# Altium schematic sheet dmpro16-pcb-v1-FPGA-Bank14.SchDoc
size A4; DocumentNumber: 5; SheetNumber: 5; SheetTotal: 17; SheetName: FPGA-Bank14
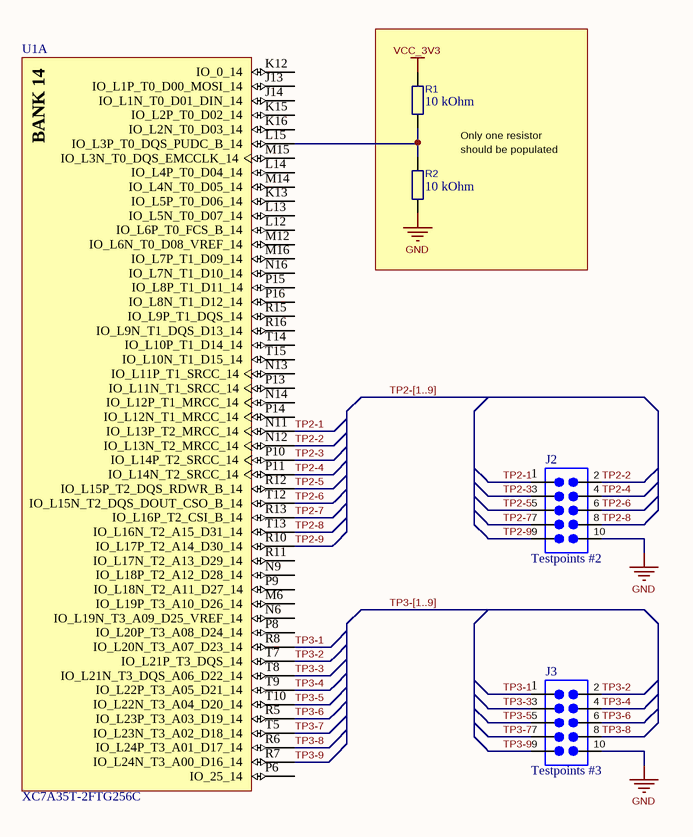
[diagram p0: dmpro16-pcb-v1-FPGA-Bank14.SchDoc]

## Parts
J2  Testpoints #2  [HEADER_2X5]
J3  Testpoints #3  [HEADER_2X5]
R1  10 kOhm  [Resistor 2012]
R2  10 kOhm  [Resistor 2012]
U1  XC7A35T-2FTG256C  [FTG256]  (part A of 8)

## Nets
GND: J2.10 J3.10 R2.2
VCC_3V3: R1.1
TP2-1: J2.1 U1.N11(IO_L13P_T2_MRCC_14)
TP2-2: J2.2 U1.N12(IO_L13N_T2_MRCC_14)
TP2-3: J2.3 U1.P10(IO_L14P_T2_SRCC_14)
TP2-4: J2.4 U1.P11(IO_L14N_T2_SRCC_14)
TP2-5: J2.5 U1.R12(IO_L15P_T2_DQS_RDWR_B_14)
TP2-6: J2.6 U1.T12(IO_L15N_T2_DQS_DOUT_CSO_B_14)
TP2-7: J2.7 U1.R13(IO_L16P_T2_CSI_B_14)
TP2-8: J2.8 U1.T13(IO_L16N_T2_A15_D31_14)
TP2-9: J2.9 U1.R10(IO_L17P_T2_A14_D30_14)
TP3-1: J3.1 U1.R8(IO_L20N_T3_A07_D23_14)
TP3-2: J3.2 U1.T7(IO_L21P_T3_DQS_14)
TP3-3: J3.3 U1.T8(IO_L21N_T3_DQS_A06_D22_14)
TP3-4: J3.4 U1.T9(IO_L22P_T3_A05_D21_14)
TP3-5: J3.5 U1.T10(IO_L22N_T3_A04_D20_14)
TP3-6: J3.6 U1.R5(IO_L23P_T3_A03_D19_14)
TP3-7: J3.7 U1.T5(IO_L23N_T3_A02_D18_14)
TP3-8: J3.8 U1.R6(IO_L24P_T3_A01_D17_14)
TP3-9: J3.9 U1.R7(IO_L24N_T3_A00_D16_14)
NetR1_2: R1.2 R2.1 U1.L15(IO_L3P_T0_DQS_PUDC_B_14)

Not connected (* = marked no-connect by the designer): U1 J13(IO_L1P_T0_D00_MOSI_14) J14(IO_L1N_T0_D01_DIN_14) K12(IO_0_14) K13(IO_L5P_T0_D06_14) K15(IO_L2P_T0_D02_14) K16(IO_L2N_T0_D03_14) L12(IO_L6P_T0_FCS_B_14) L13(IO_L5N_T0_D07_14) L14(IO_L4P_T0_D04_14) M6(IO_L19P_T3_A10_D26_14) M12(IO_L6N_T0_D08_VREF_14) M14(IO_L4N_T0_D05_14) M15(IO_L3N_T0_DQS_EMCCLK_14) M16(IO_L7P_T1_D09_14) N6(IO_L19N_T3_A09_D25_VREF_14) N9(IO_L18P_T2_A12_D28_14) N13(IO_L11P_T1_SRCC_14) N14(IO_L12P_T1_MRCC_14) N16(IO_L7N_T1_D10_14) P6(IO_25_14) P8(IO_L20P_T3_A08_D24_14) P9(IO_L18N_T2_A11_D27_14) P13(IO_L11N_T1_SRCC_14) P14(IO_L12N_T1_MRCC_14) P15(IO_L8P_T1_D11_14) P16(IO_L8N_T1_D12_14) R11(IO_L17N_T2_A13_D29_14) R15(IO_L9P_T1_DQS_14) R16(IO_L9N_T1_DQS_D13_14) T14(IO_L10P_T1_D14_14) T15(IO_L10N_T1_D15_14)

## Buses and harness runs
bus TP2-[1..9]
bus TP3-[1..9]

## Notes on the sheet
- Only one resistor
- should be populated
- Board:
- Version:
- Sheetname:
- Subject:
- Group:
- Sheet
- of
- Shematic file:
- (in symbol XC7A35T-2FTG256C, part A) BANK 14

## Library data of the parts
J2 J3 = con_head_2x05pin: Header 2x05pin
R1 R2 = res_1608_10kohm: 10 kOhm resistor (1608 metric); Watt rating: ? mW; Value: 10 kOhm
U1 = XC7A35T-2FTG256C: Artix-7 FPGA, 170 User I/Os, 0 GTP, 256-Ball BGA, Speed Grade 2, Commercial Grade, Pb-Free; Manufacturer: Xilinx; Total Block RAM: 1800 Kb; GTP: 0; Clock Mgmt Tiles (CMTs): 5; Logic Cells: 33280; Available User I/O: 170; Speed Grades: 2; DatasheetVersion: v1.15; PackageVersion: Rev. 1.11; PackageReference: FTG-256; PackageDescription: 256-Ball Wire-Bond Fine-Pitch Thin BGA, Body 17 x 17 mm, Pitch 1 mm; Maximum Distributed RAM: 400 Kb; Operating Temperature Range: Commercial; NexusDeviceID: XC7A35T-2FTG256C; Mounting Technology: Surface Mount; PartNumber: XC7A35T-2FTG256C; ComponentLink1Description: Manufacturer URL; ComponentLink1URL: http://www.xilinx.com/; ComponentLink2Description: Datasheet; ComponentLink2URL: http://www.xilinx.com/support/documentation/data_sheets/ds180_7Series_Overview.pdf; ComponentLink3Description: Package Specification; ComponentLink3URL: http://www.xilinx.com/support/documentation/user_guides/ug475_7Series_Pkg_Pinout.pdf; ComponentLink4Description: DC and Switching Characteristics; ComponentLink4URL: http://www.xilinx.com/support/documentation/data_sheets/ds181_Artix_7_Data_Sheet.pdf; ComponentLink5Description: Package File; ComponentLink5URL: http://www.xilinx.com/support/packagefiles/a7packages/xc7a200tsbg484pkg.txt; ComponentLink6Description: Packaging and Pinout; ComponentLink6URL: http://www.xilinx.com/support/documentation/user_guides/ug475_7Series_Pkg_Pinout.pdf